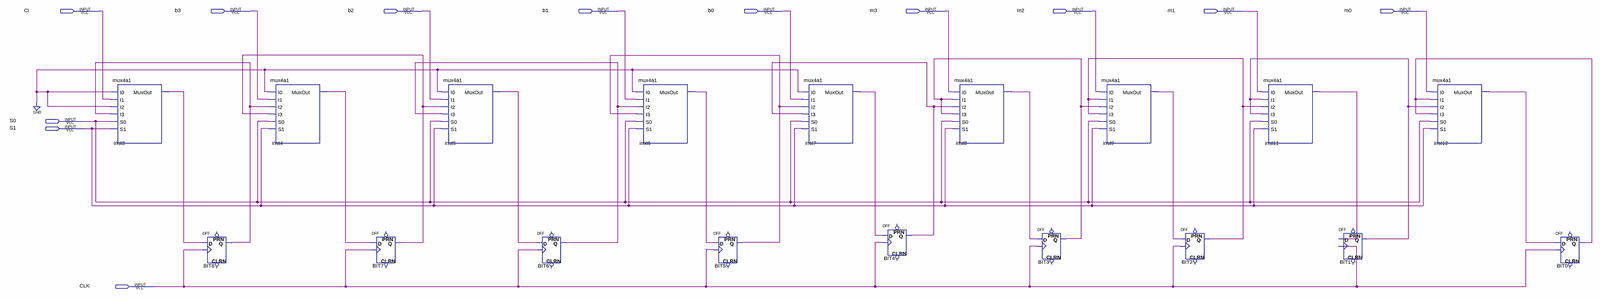
[diagram p0: schematic sheet, whole]
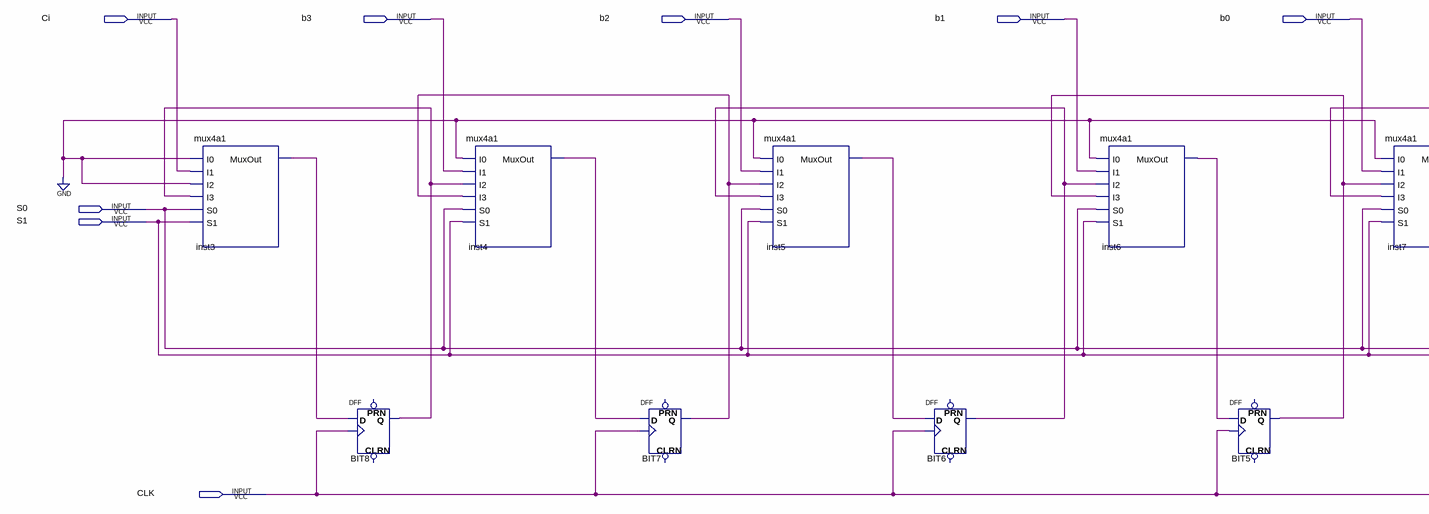
[diagram p1: schematic sheet, left part]
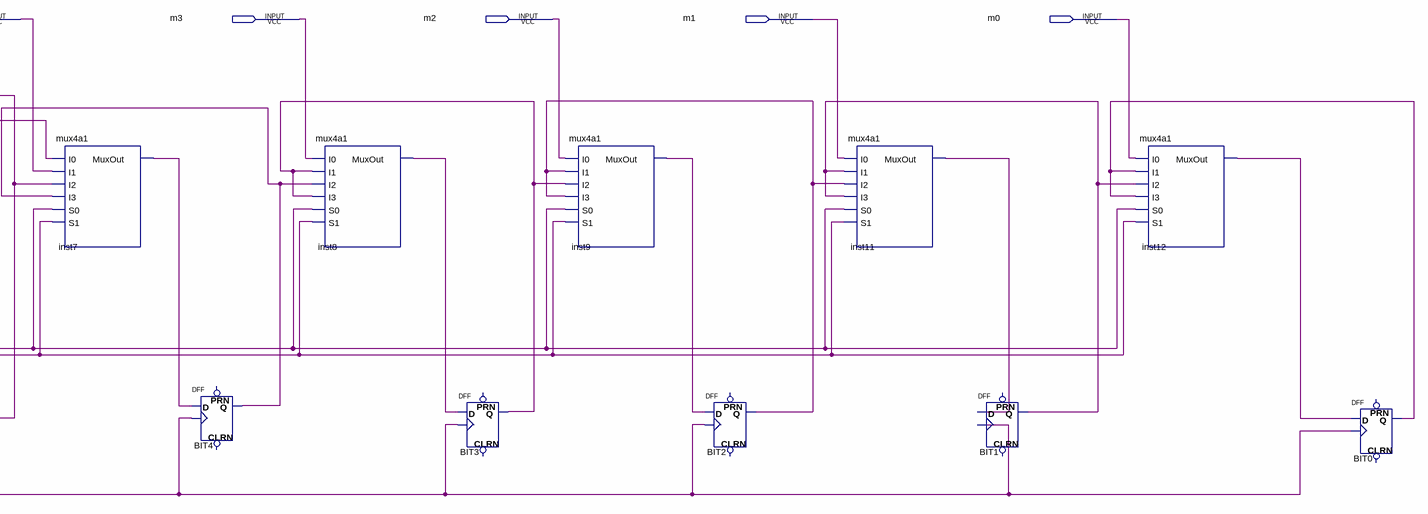
[diagram p2: schematic sheet, right part]
// Quartus schematic registro.bdf as structural Verilog: 18 symbols, 12 pins
module registro (
  input  Ci,
  input  b3,
  input  b2,
  input  b1,
  input  b0,
  input  m3,
  input  m2,
  input  m1,
  input  m0,
  input  S0,
  input  S1,
  input  CLK
);

  wire BIT0_q, BIT1_q, BIT2_q, BIT3_q, BIT4_q, BIT5_q, BIT6_q, BIT7_q, BIT8_q, inst3_muxout, inst4_muxout,
       inst5_muxout, inst6_muxout, inst7_muxout, inst8_muxout, inst9_muxout, inst11_muxout, inst12_muxout;

  mux4a1 inst3 (.I0(1'b0), .I1(Ci), .I2(1'b0), .I3(BIT8_q), .S0(S0), .S1(S1), .MuxOut(inst3_muxout));
  DFF BIT8 (.CLK(CLK), .D(inst3_muxout), .Q(BIT8_q));  // open: CLRN, PRN
  mux4a1 inst4 (.I0(1'b0), .I1(b3), .I2(BIT8_q), .I3(BIT7_q), .S0(S0), .S1(S1), .MuxOut(inst4_muxout));
  DFF BIT7 (.CLK(CLK), .D(inst4_muxout), .Q(BIT7_q));  // open: CLRN, PRN
  mux4a1 inst5 (.I0(1'b0), .I1(b2), .I2(BIT7_q), .I3(BIT6_q), .S0(S0), .S1(S1), .MuxOut(inst5_muxout));
  DFF BIT6 (.CLK(CLK), .D(inst5_muxout), .Q(BIT6_q));  // open: CLRN, PRN
  mux4a1 inst6 (.I0(1'b0), .I1(b1), .I2(BIT6_q), .I3(BIT5_q), .S0(S0), .S1(S1), .MuxOut(inst6_muxout));
  DFF BIT5 (.CLK(CLK), .D(inst6_muxout), .Q(BIT5_q));  // open: CLRN, PRN
  mux4a1 inst7 (.I0(1'b0), .I1(b0), .I2(BIT5_q), .I3(BIT4_q), .S0(S0), .S1(S1), .MuxOut(inst7_muxout));
  DFF BIT4 (.CLK(CLK), .D(inst7_muxout), .Q(BIT4_q));  // open: CLRN, PRN
  mux4a1 inst8 (.I0(m3), .I1(BIT3_q), .I2(BIT4_q), .I3(BIT3_q), .S0(S0), .S1(S1), .MuxOut(inst8_muxout));
  DFF BIT3 (.CLK(CLK), .D(inst8_muxout), .Q(BIT3_q));  // open: CLRN, PRN
  mux4a1 inst9 (.I0(m2), .I1(BIT2_q), .I2(BIT3_q), .I3(BIT2_q), .S0(S0), .S1(S1), .MuxOut(inst9_muxout));
  DFF BIT2 (.CLK(CLK), .D(inst9_muxout), .Q(BIT2_q));  // open: CLRN, PRN
  mux4a1 inst11 (.I0(m1), .I1(BIT1_q), .I2(BIT2_q), .I3(BIT1_q), .S0(S0), .S1(S1), .MuxOut(inst11_muxout));
  DFF BIT1 (.CLK(CLK), .D(inst11_muxout), .Q(BIT1_q));  // open: CLRN, PRN
  mux4a1 inst12 (.I0(m0), .I1(BIT0_q), .I2(BIT1_q), .I3(BIT0_q), .S0(S0), .S1(S1), .MuxOut(inst12_muxout));
  DFF BIT0 (.CLK(CLK), .D(inst12_muxout), .Q(BIT0_q));  // open: CLRN, PRN
endmodule
